# EasyEDA Pro project LedStrip_Example.eprj

# Schematic Schematic1
Create Date: 2023-12-26; Page Name: P1; Project Name: LedStrip Example; Schematic Name: Schematic1; Update Date: 2023-12-26; Company: EasyEDA.com; Drawed: EasyEDA Pro; Page Size: A4; Part Number: JLCPCB-002; Reviewed: EasyEDA Pro; Version: V0.1
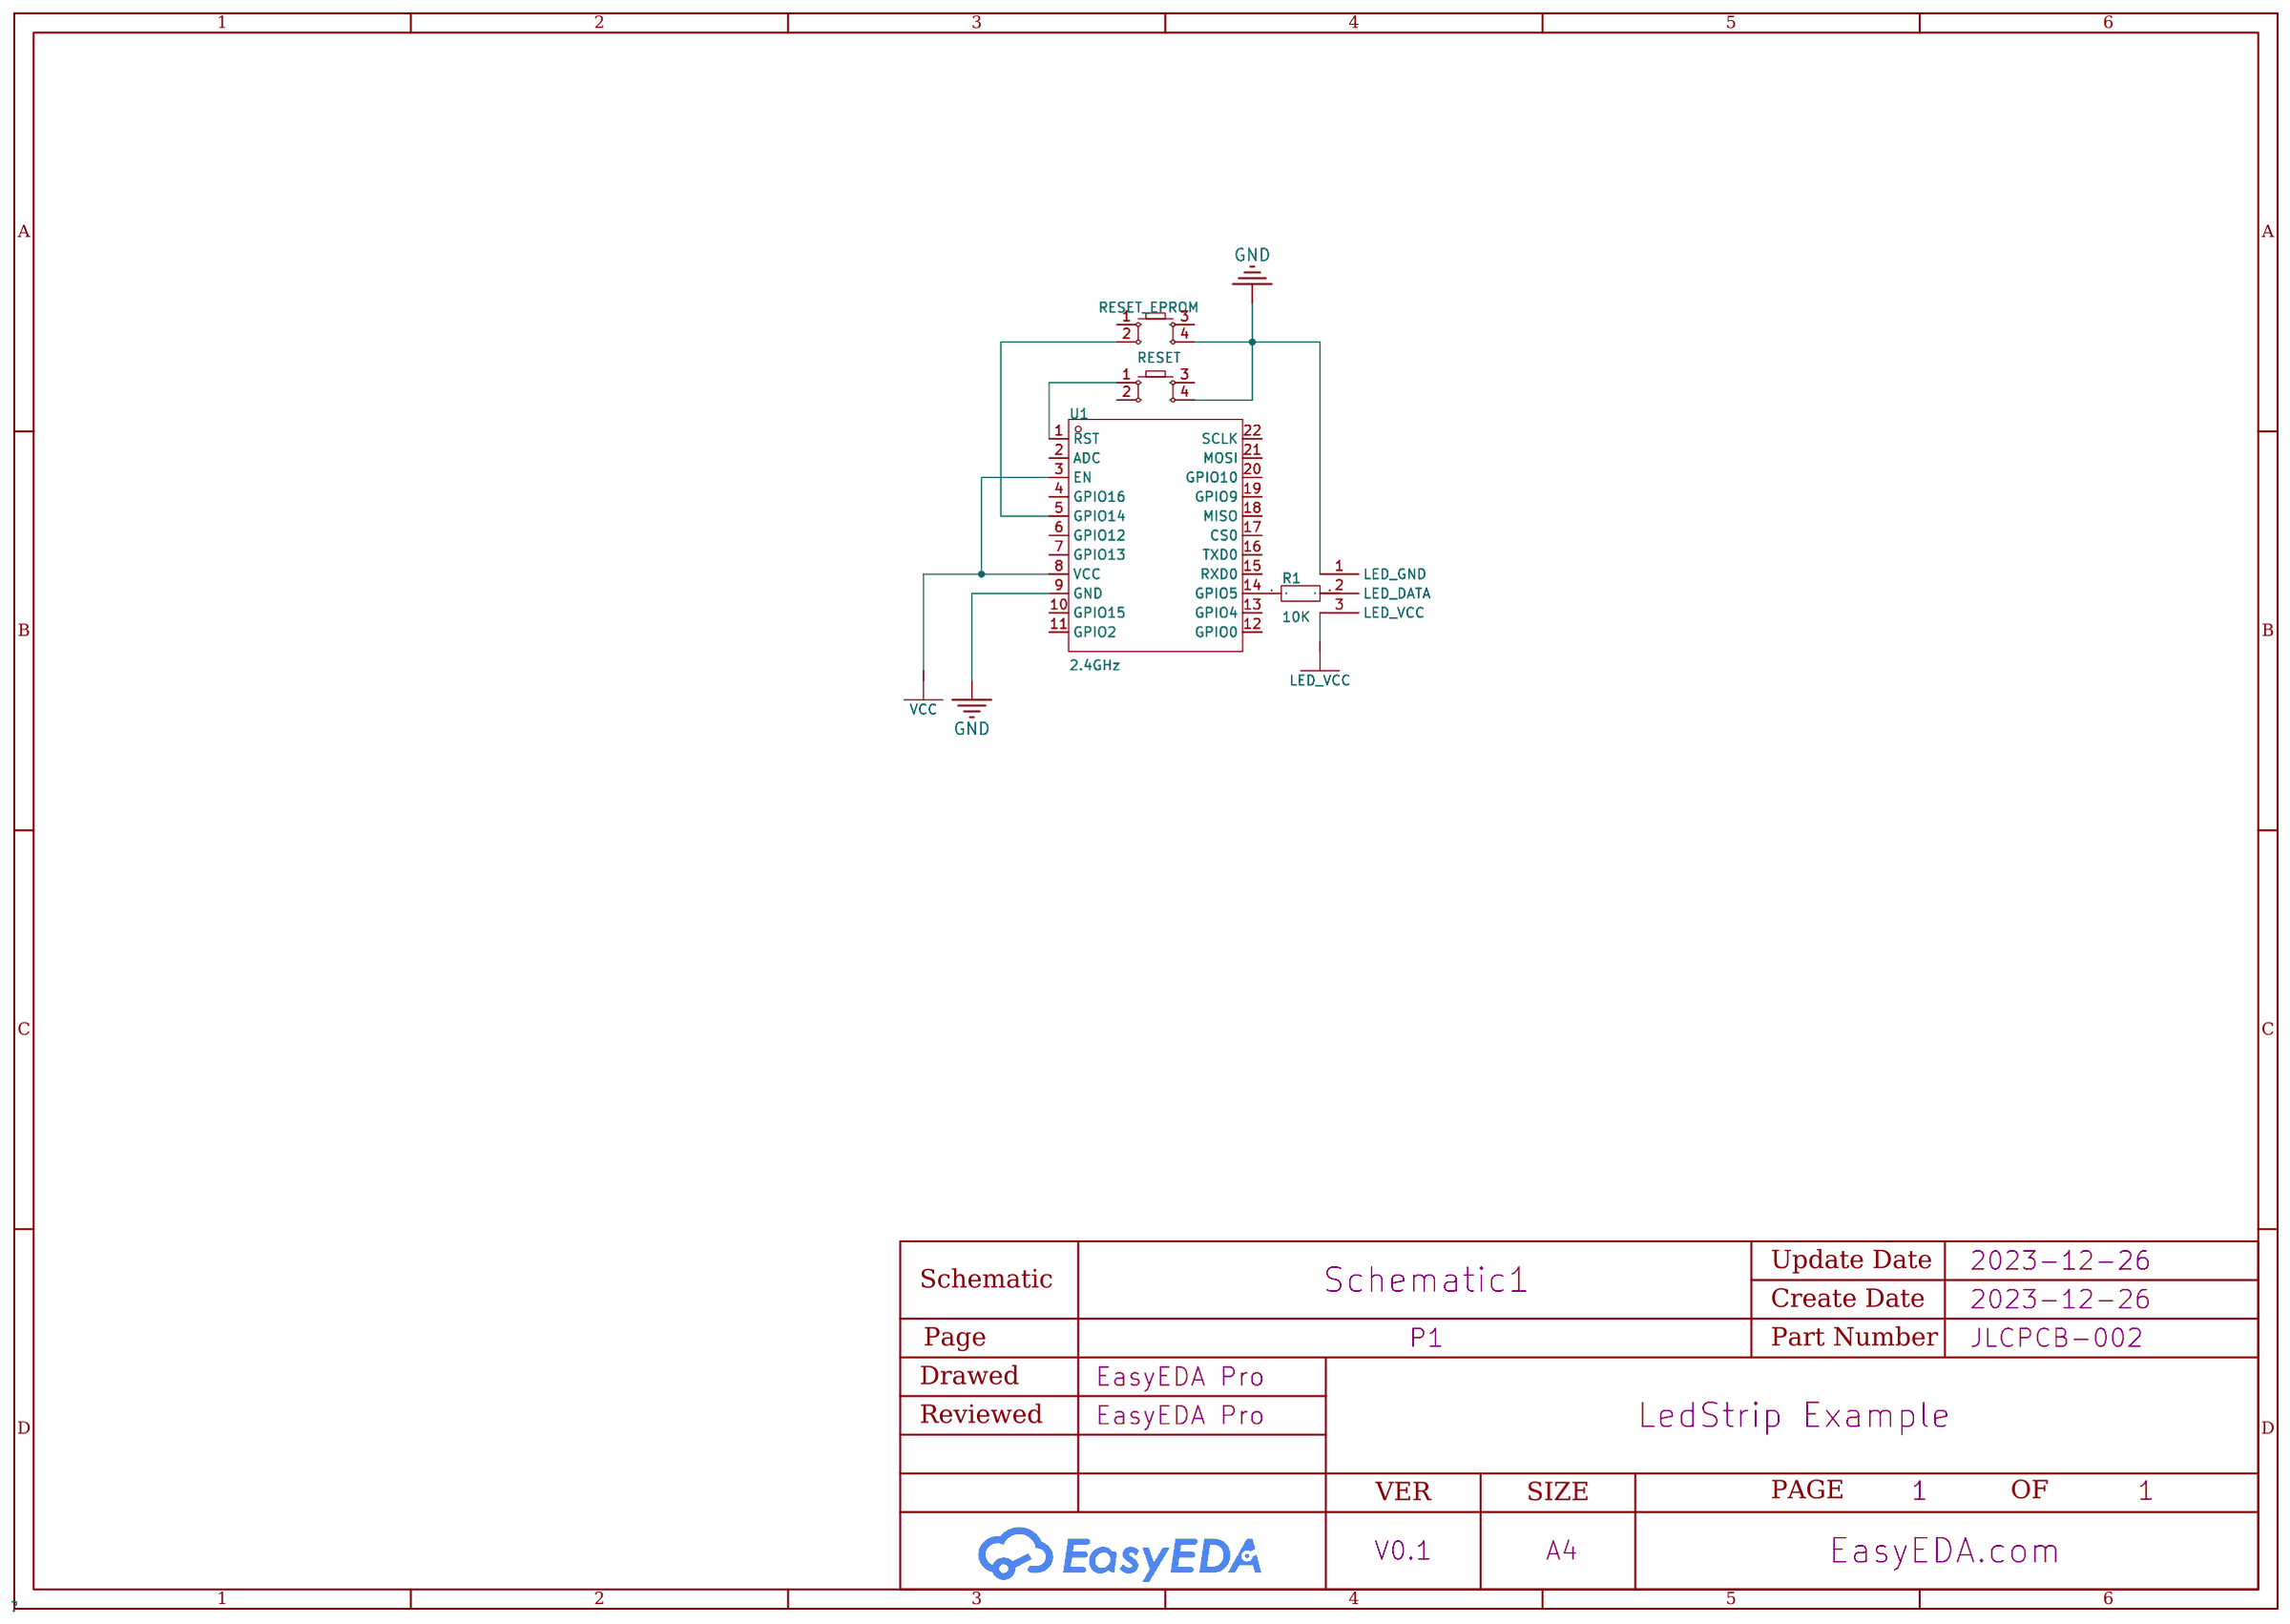
[diagram p0: schematic sheet]

## Parts
R1  10K  [R0603]
RESET  -  [KEY-TH_4P-L6.0-W6.0-P3.90-LS6.5]
RESET_EPROM  -  [KEY-TH_4P-L6.0-W6.0-P3.90-LS6.5]
U1  2.4GHz  [WIFIM-SMD_ESP-12F-ESP8266MOD]
U2  -

## Library data of the parts
R1 = Res_0603: Supplier Footprint: 0603
RESET RESET_EPROM = Key_TH_6x6x4.5: Supplier Footprint: Through
U1 = ESP-12F(ESP8266MOD): Frequency:2.4GHz Output Power:16dBm Output Power:16dBm Core Processor:ESP8266 Support Interface:GPIO；UART；I2C；PWM；SPI；ADC Antenna Type:PCB 板载天线 Wireless Standard:802.11b/g/n Operating Voltage:3.3V Operating Voltage:3.3V Receive  Current:120mA Send  Curren; LCSC Part Name: 完整的802.11b/g/n Wi-Fi的SoC模块; Supplier Part: C82891; Manufacturer: Ai-Thinker(安信可); Supplier Footprint: SMD,16x24mm; JLCPCB Part Class: Extended Part; Datasheet: https://atta.szlcsc.com/upload/public/pdf/source/20210219/C82891_ABD84A460F4F056A2757267CCCA4B508.pdf; Supplier: LCSC; Output Power: 16dBm; Core Processor: ESP8266; Support Interface: GPIO；UART；I2C；PWM；SPI；ADC; Antenna Type: PCB 板载天线; Wireless Standard: 802.11b/g/n; Operating Voltage: 3.3V; Receive  Current: 120mA; Send  Current: 170mA; Sensitivity: -90dBm; Operating Temperature: -40℃~+85℃
U2 = 3 pins for led

## Nets
GND: RESET.4 RESET_EPROM.4 U1.9(GND) U2.1(LED_GND)
VCC: U1.3(EN) U1.8(VCC)
LED_VCC: U2.3(LED_VCC)
Net-(R1-1): R1.1 U1.14(GPIO5)
Net-(R1-2): R1.2 U2.2(LED_DATA)
Net-(RESET-1): RESET.1 U1.1(RST)
Net-(RESET_EPROM-2): RESET_EPROM.2 U1.5(GPIO14)

Not connected (* = marked no-connect by the designer): RESET 2 3; RESET_EPROM 1 3; U1 2(ADC) 4(GPIO16) 6(GPIO12) 7(GPIO13) 10(GPIO15) 11(GPIO2) 12(GPIO0) 13(GPIO4) 15(RXD0) 16(TXD0) 17(CS0) 18(MISO) 19(GPIO9) 20(GPIO10) 21(MOSI) 22(SCLK)
